# EAGLE schematic 612_jetracer_pico_300 (EAGLE 9.6.0)
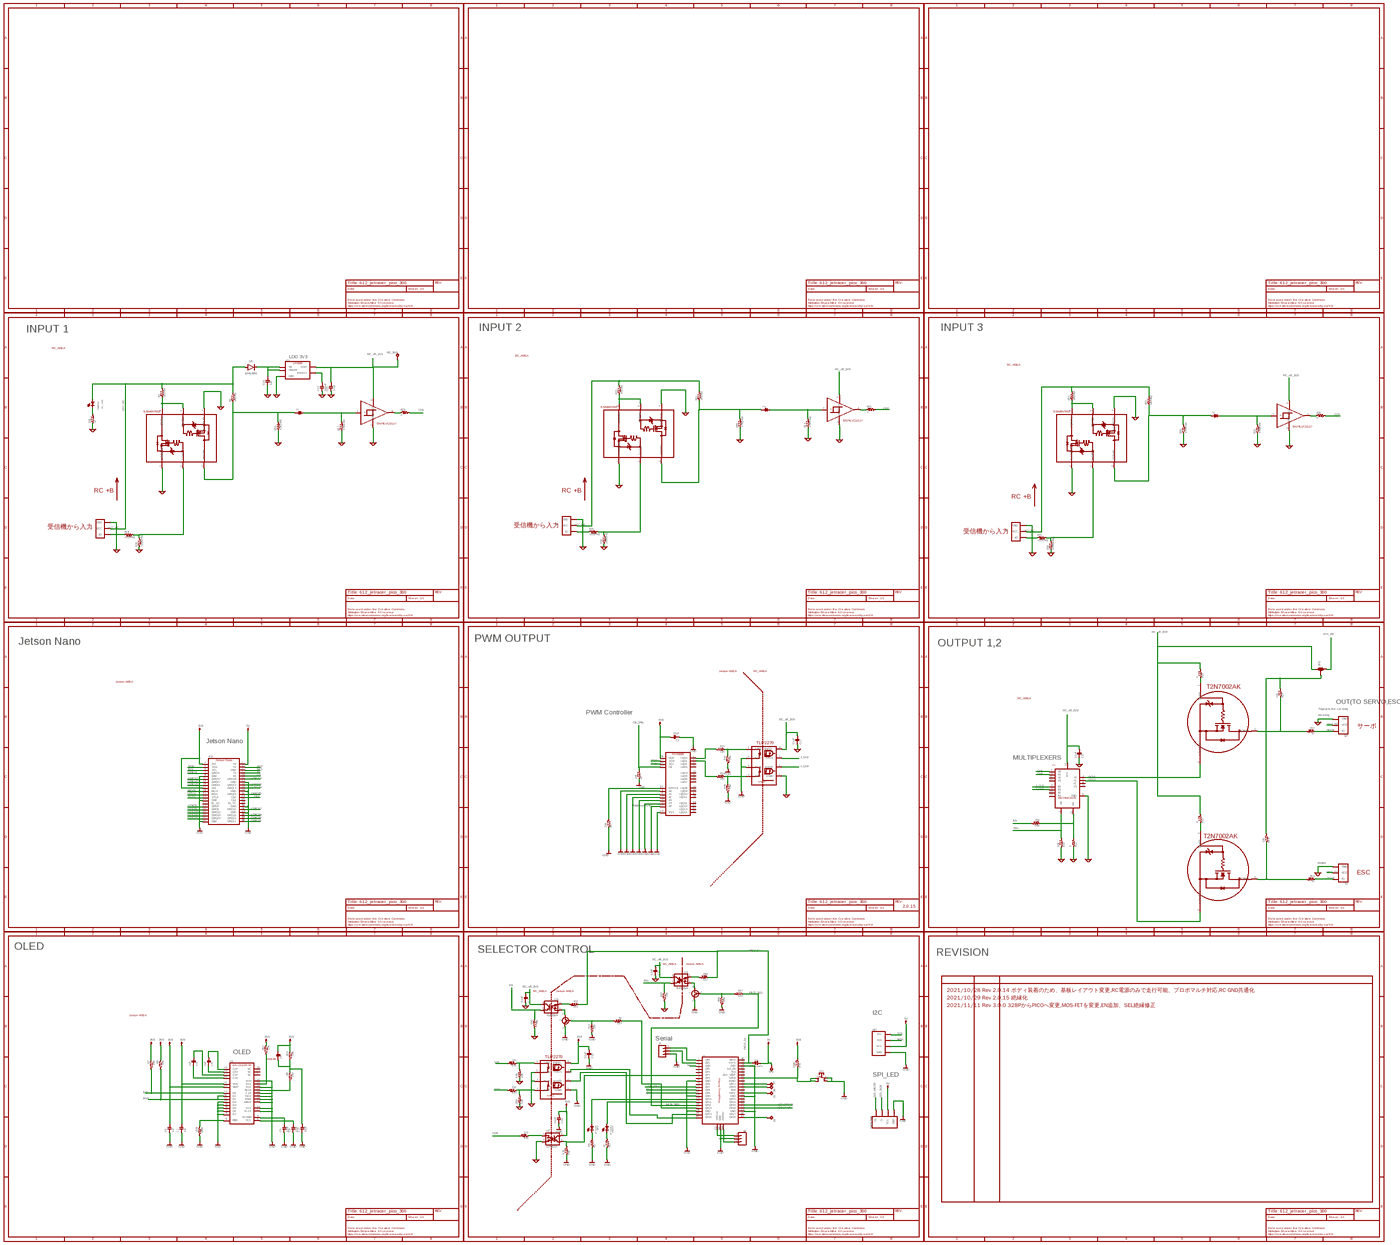
[diagram p0: schematic, sheet 1, overview]
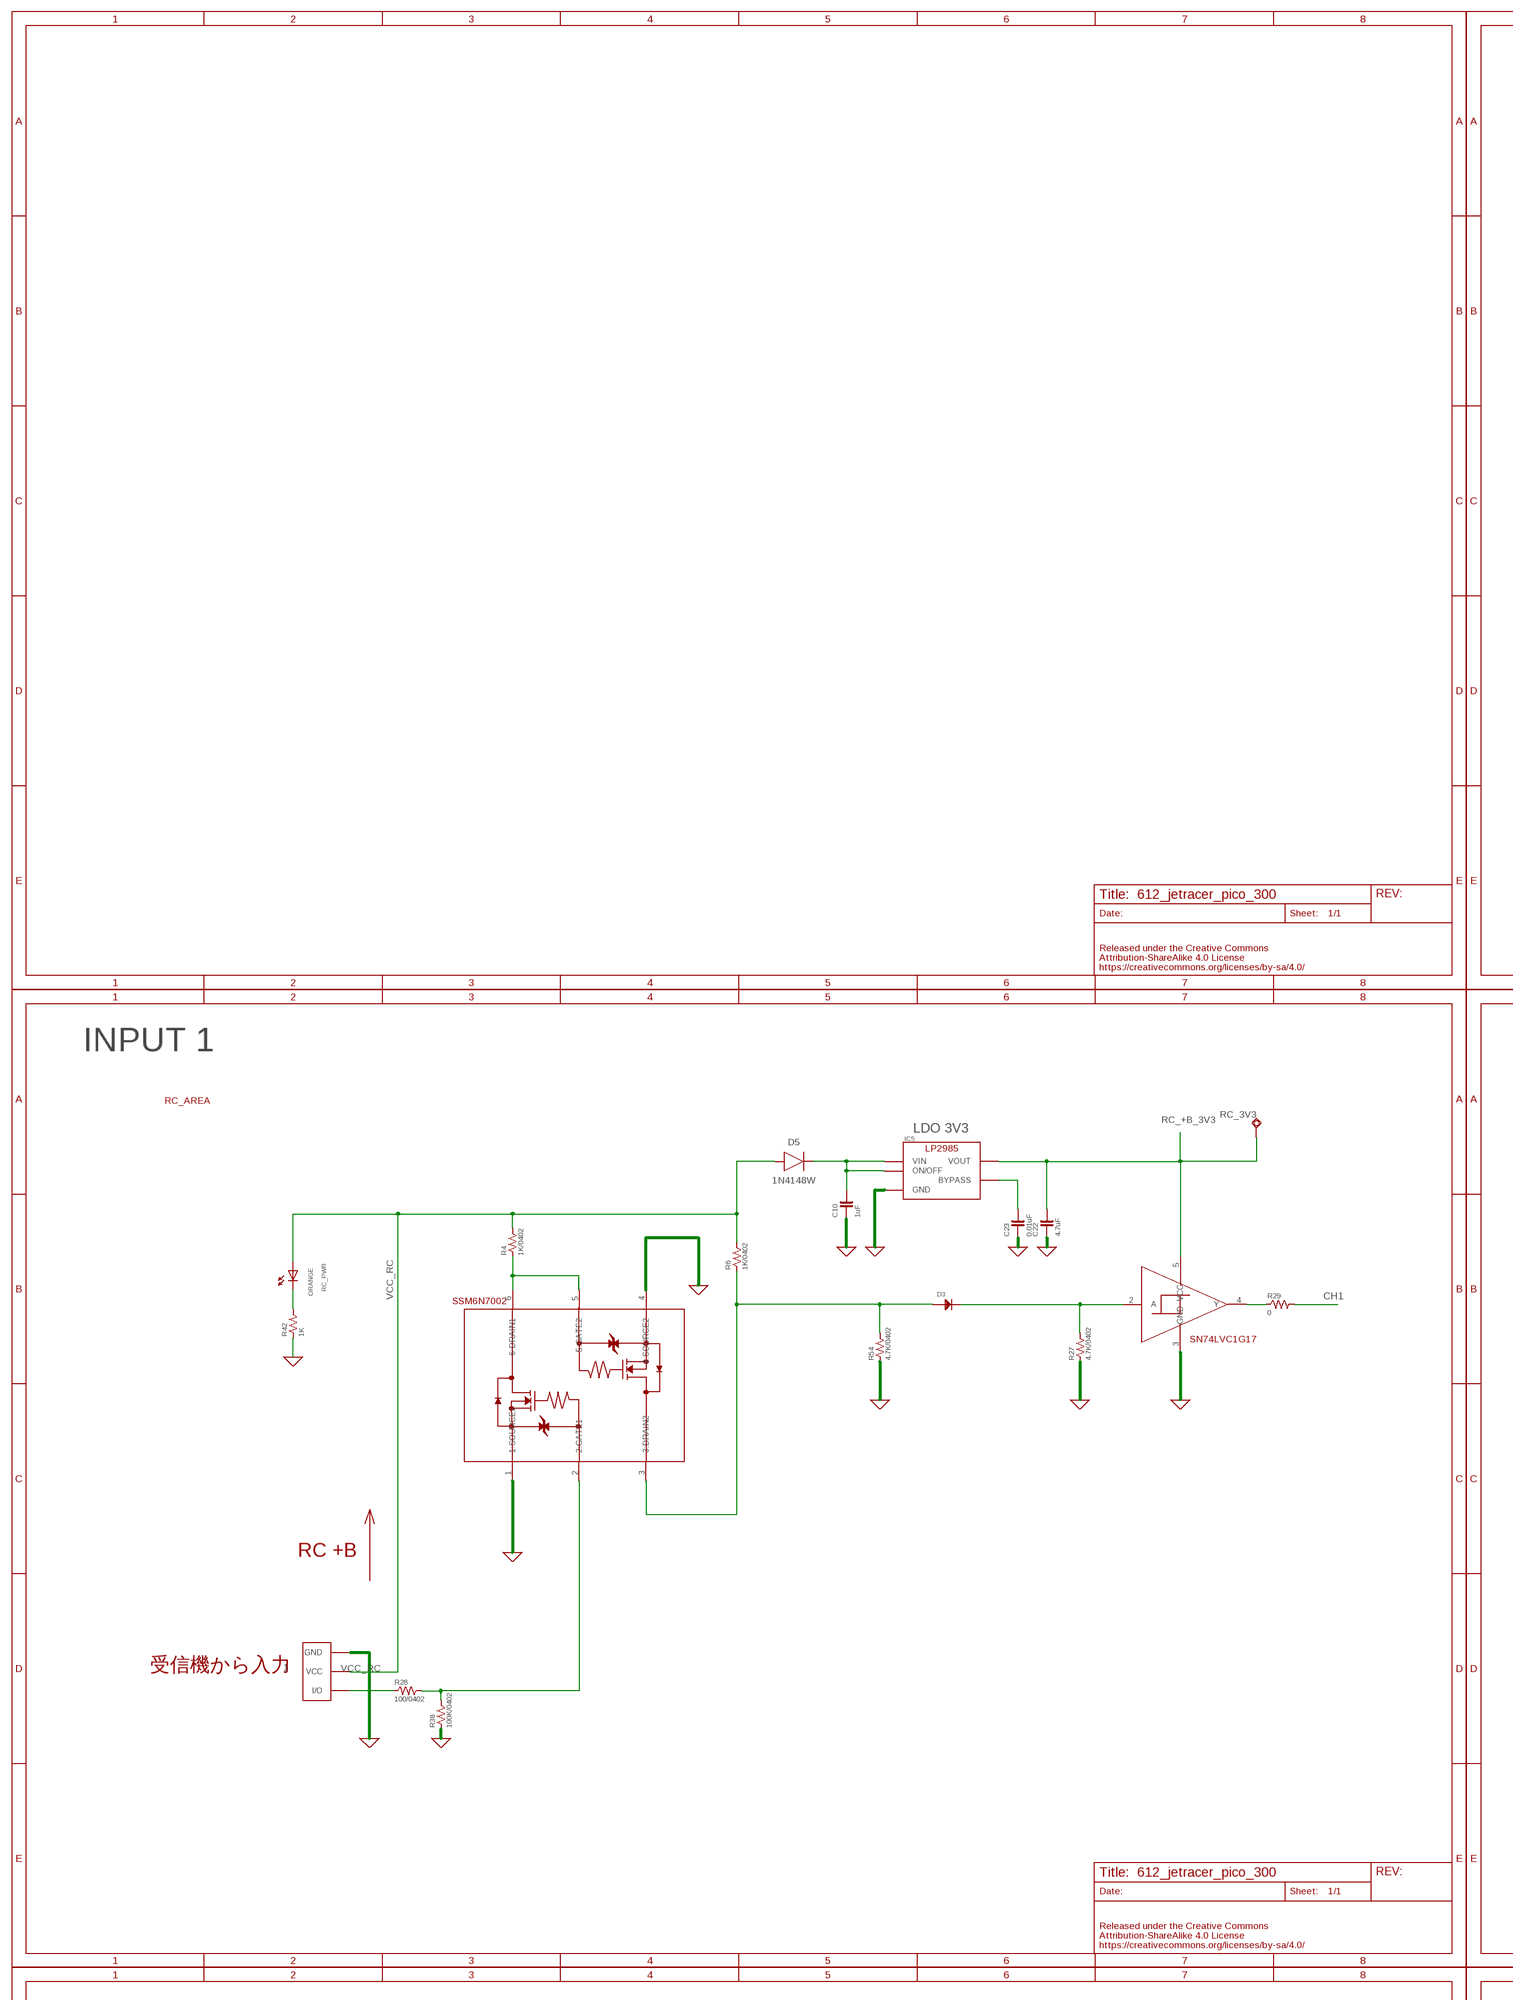
[diagram p1: schematic, sheet 1, part 1 of 6]
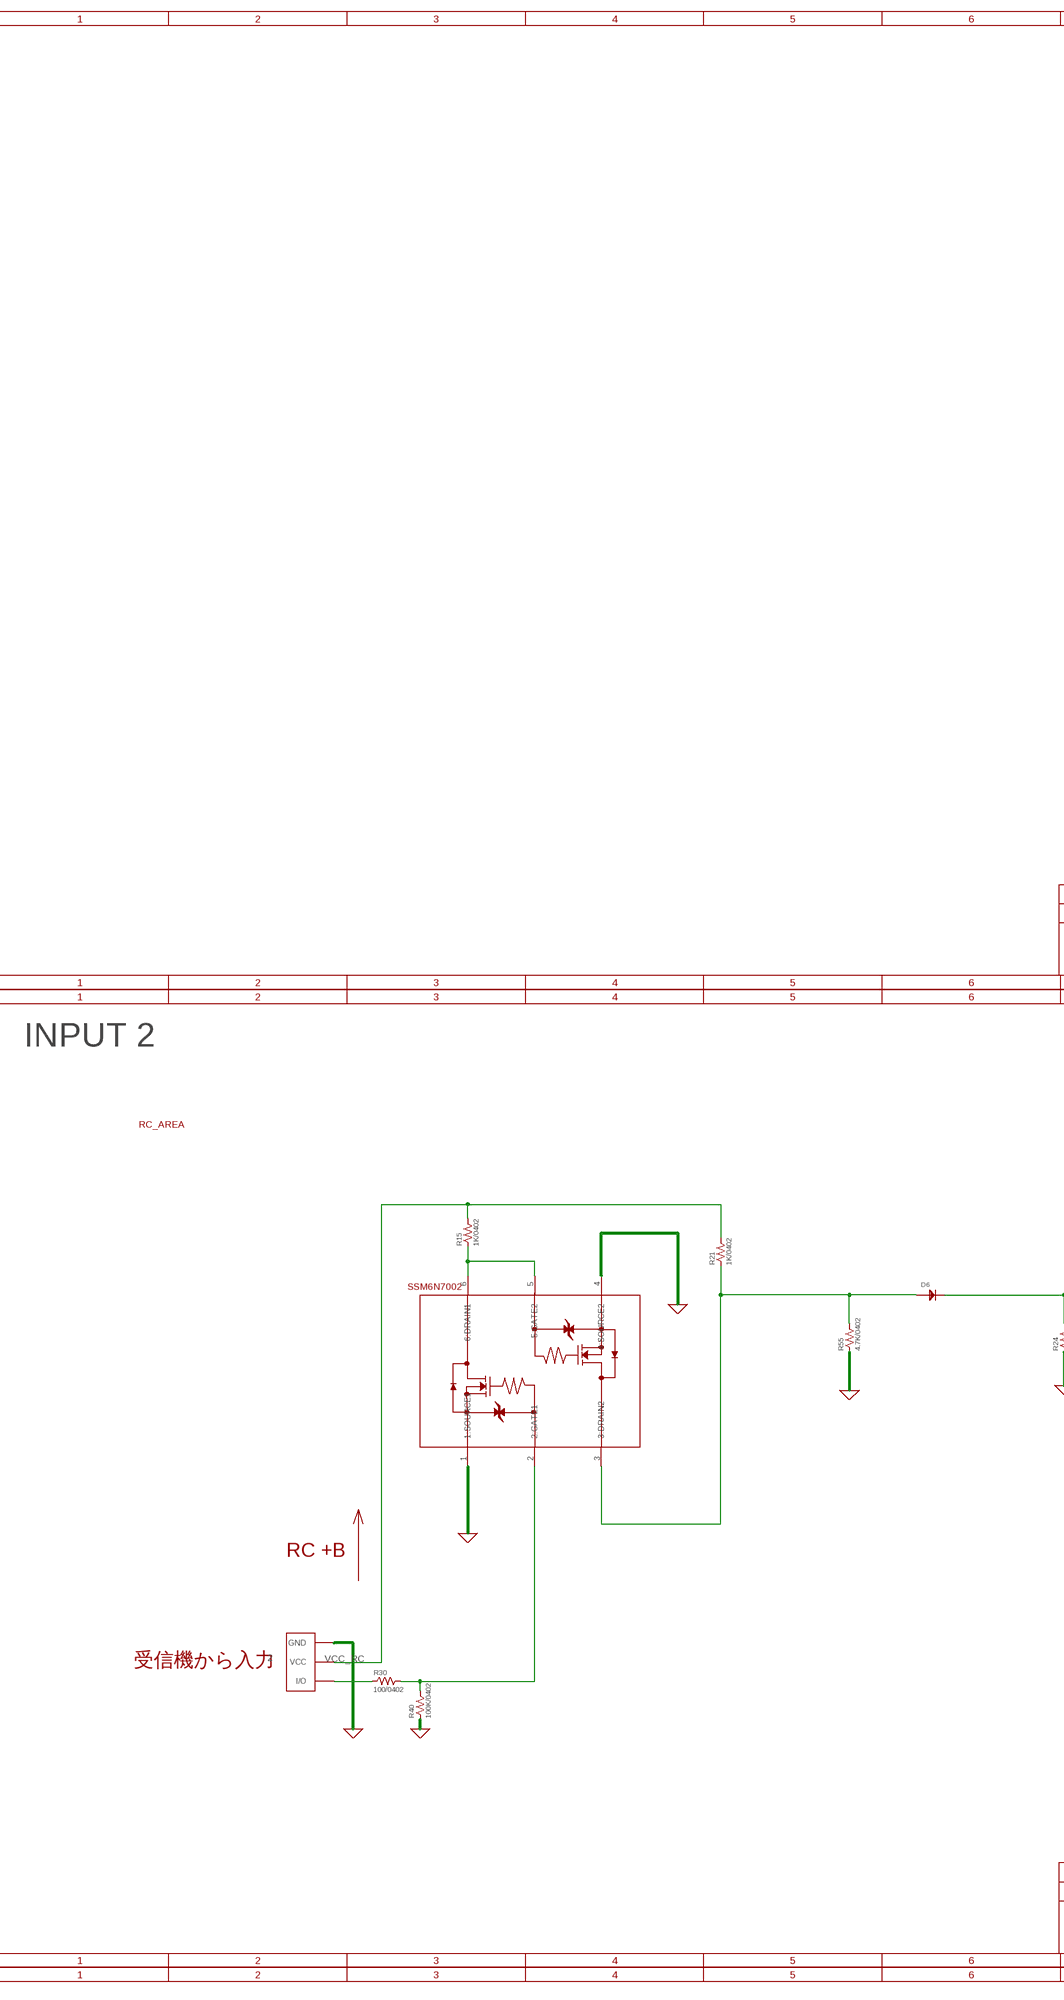
[diagram p2: schematic, sheet 1, part 2 of 6]
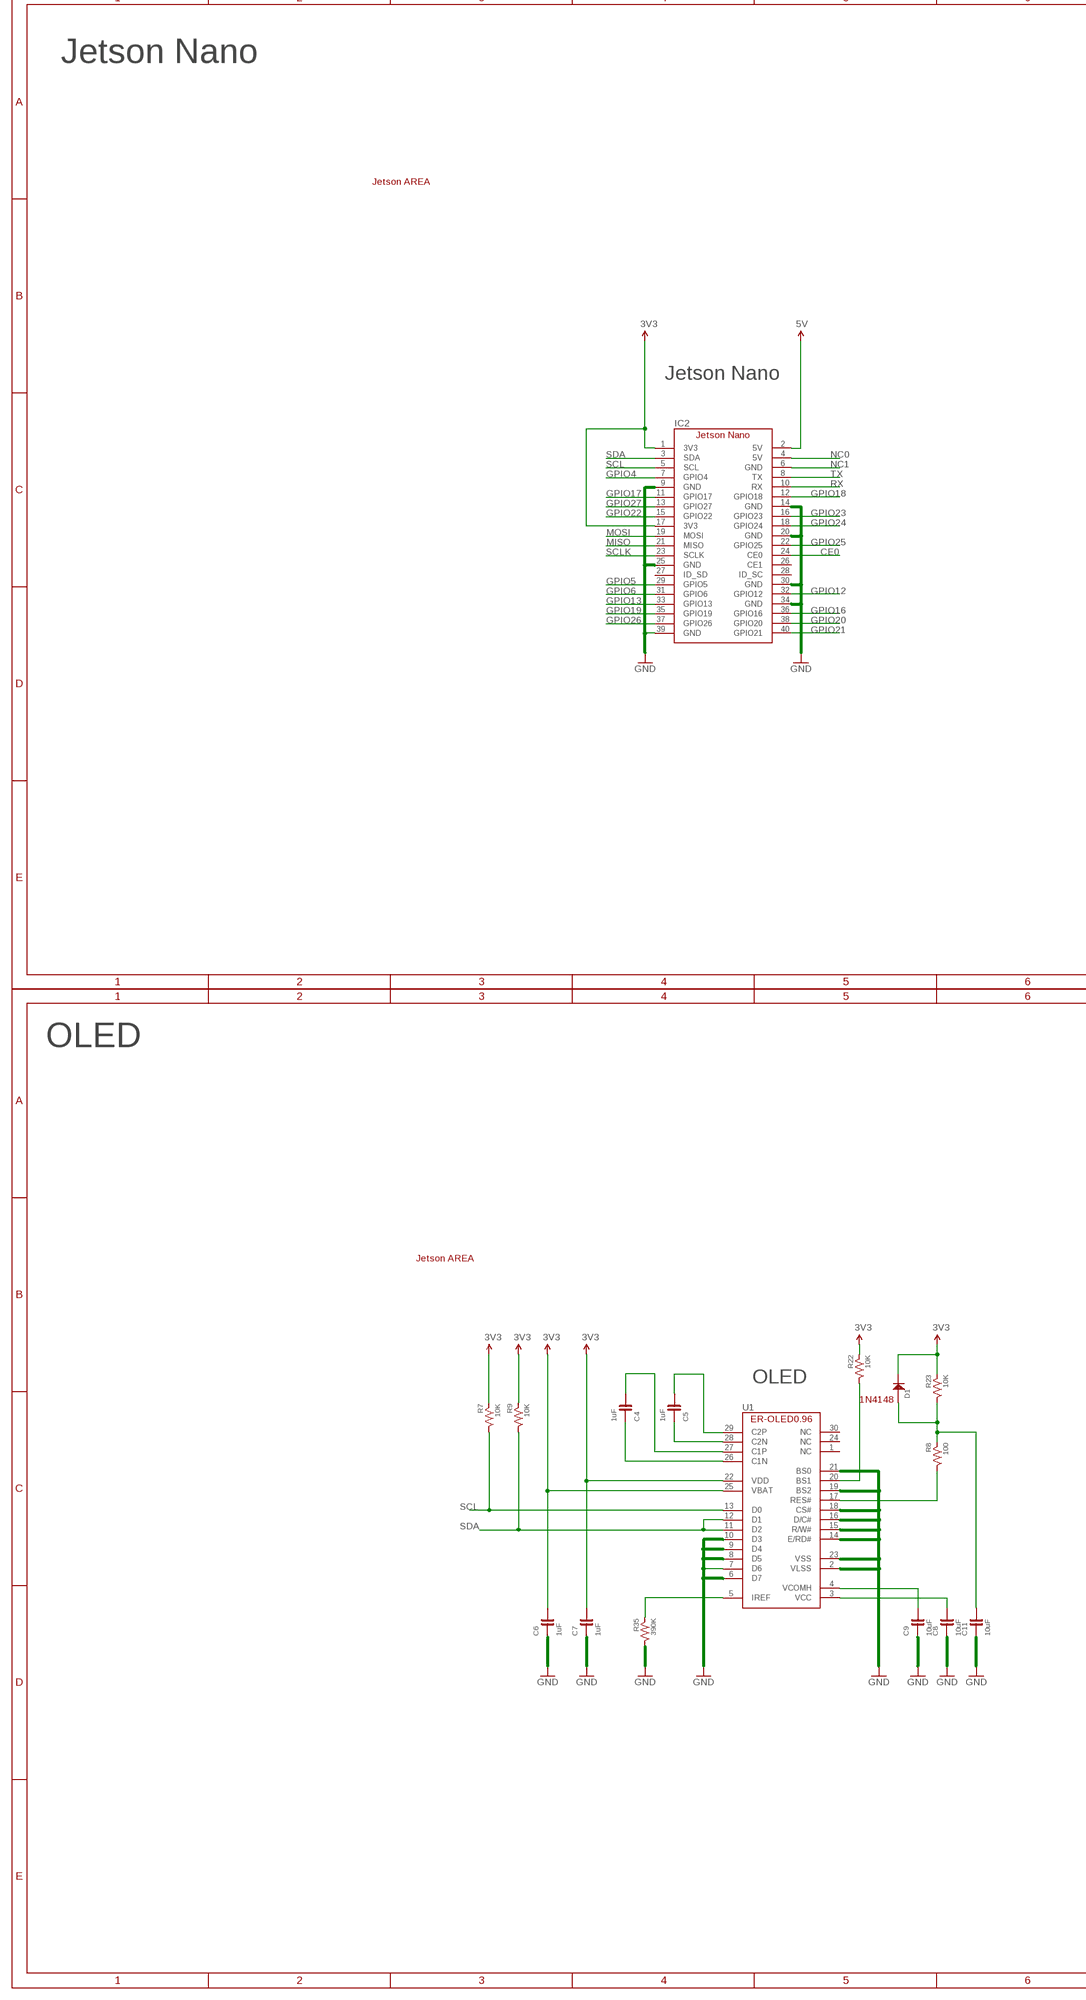
[diagram p3: schematic, sheet 1, part 3 of 6]
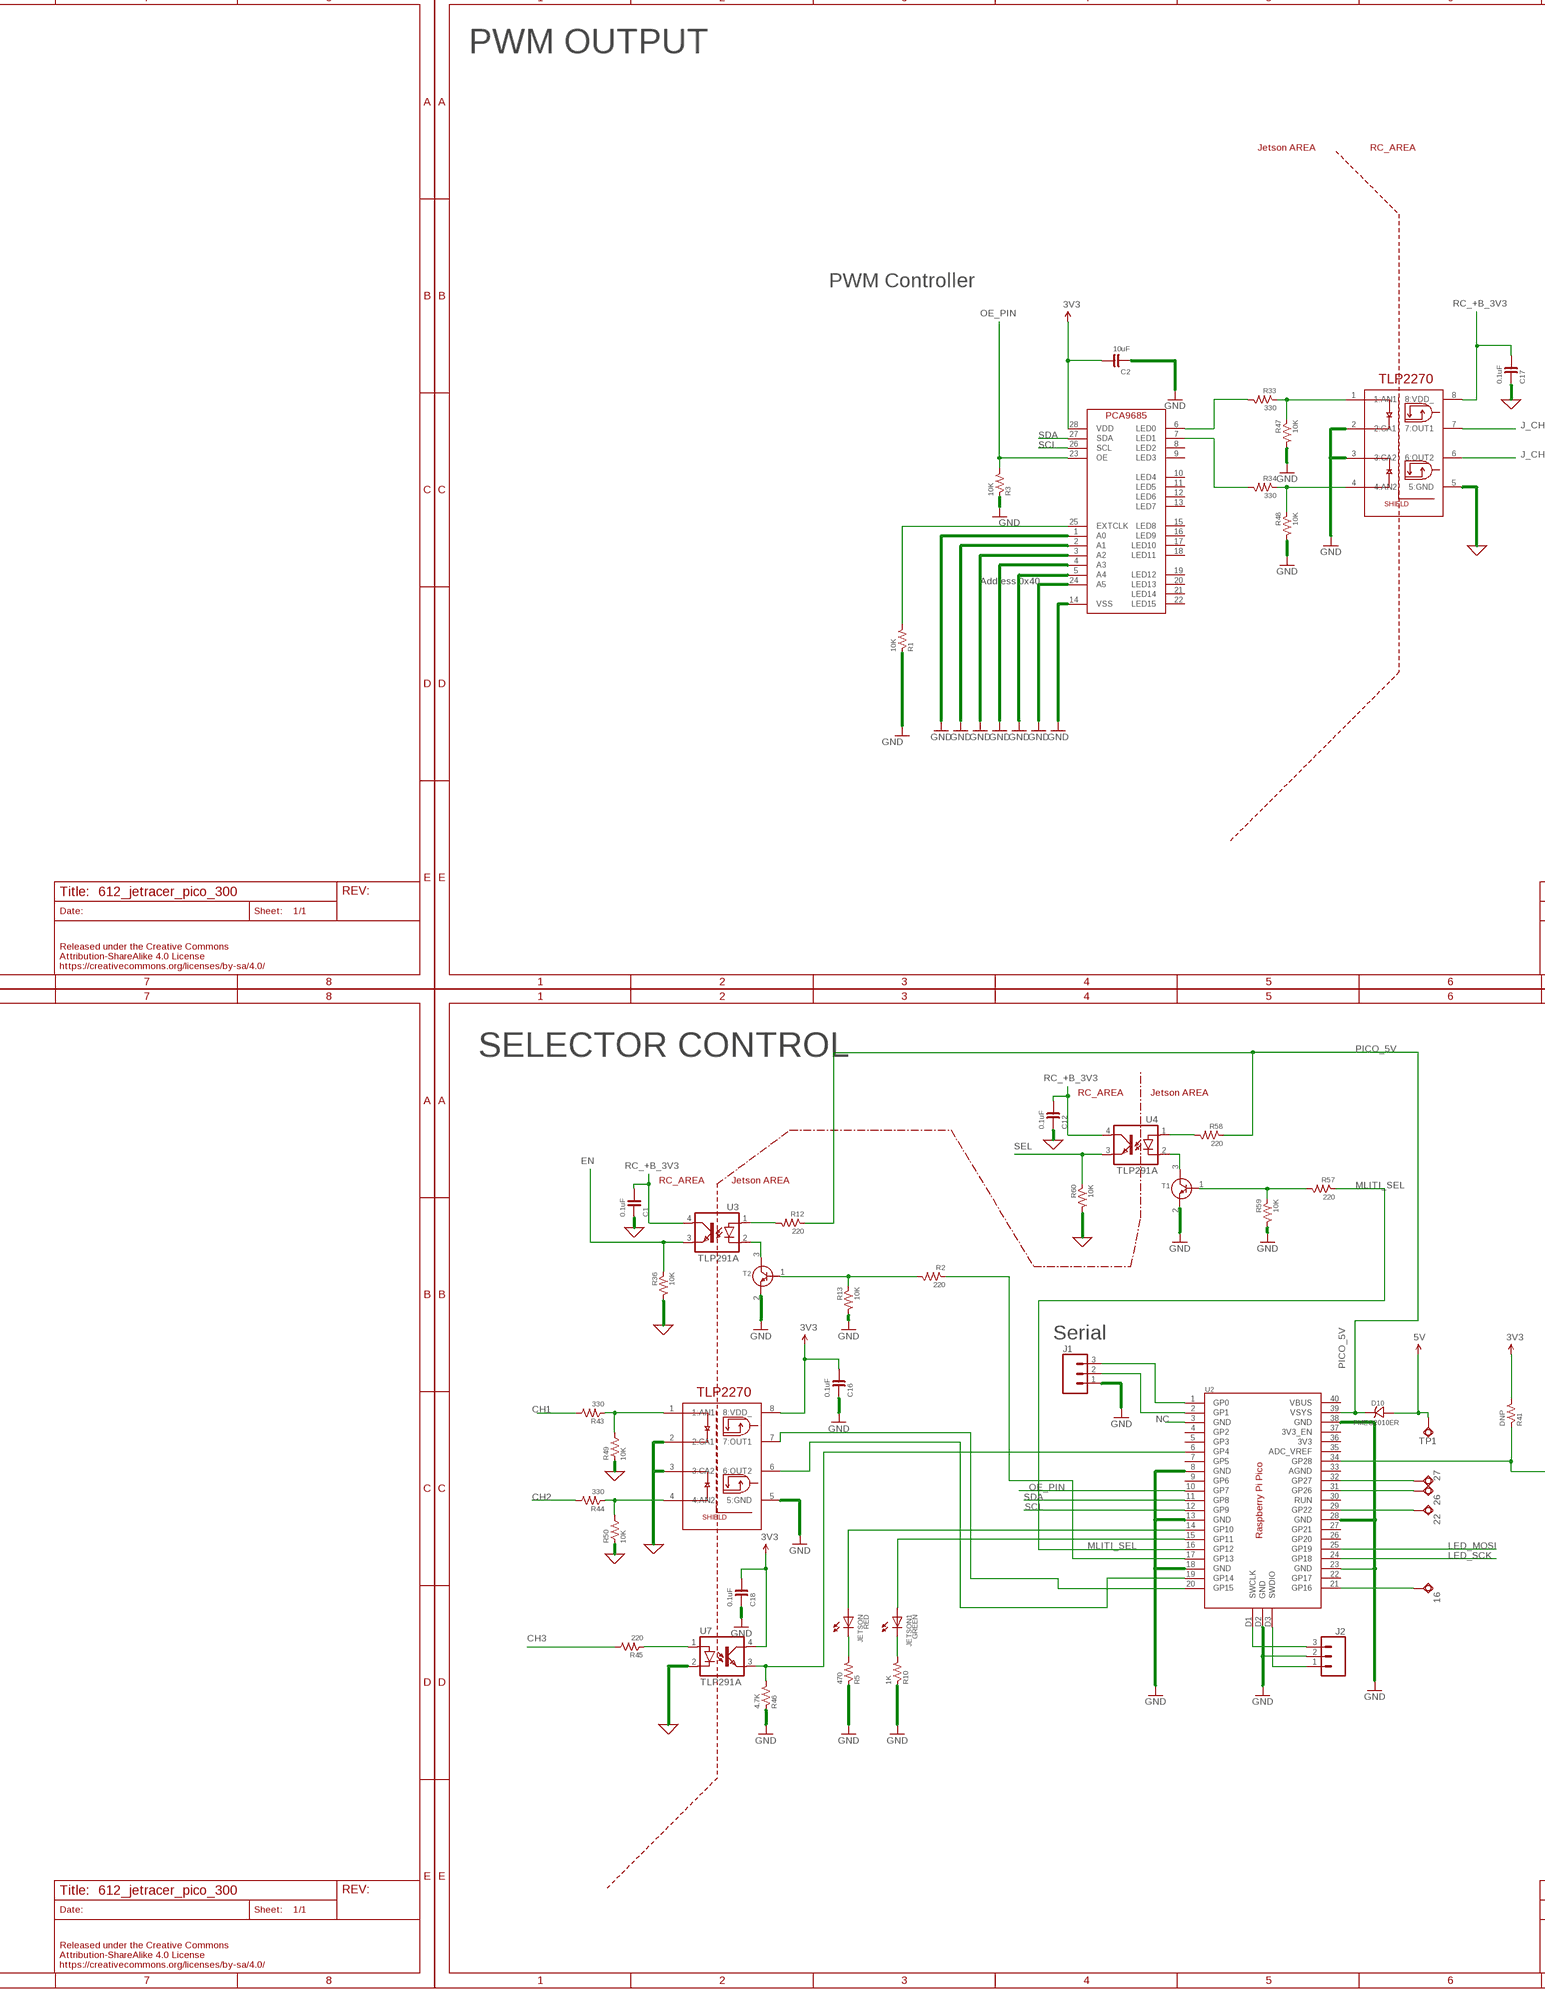
[diagram p4: schematic, sheet 1, part 4 of 6]
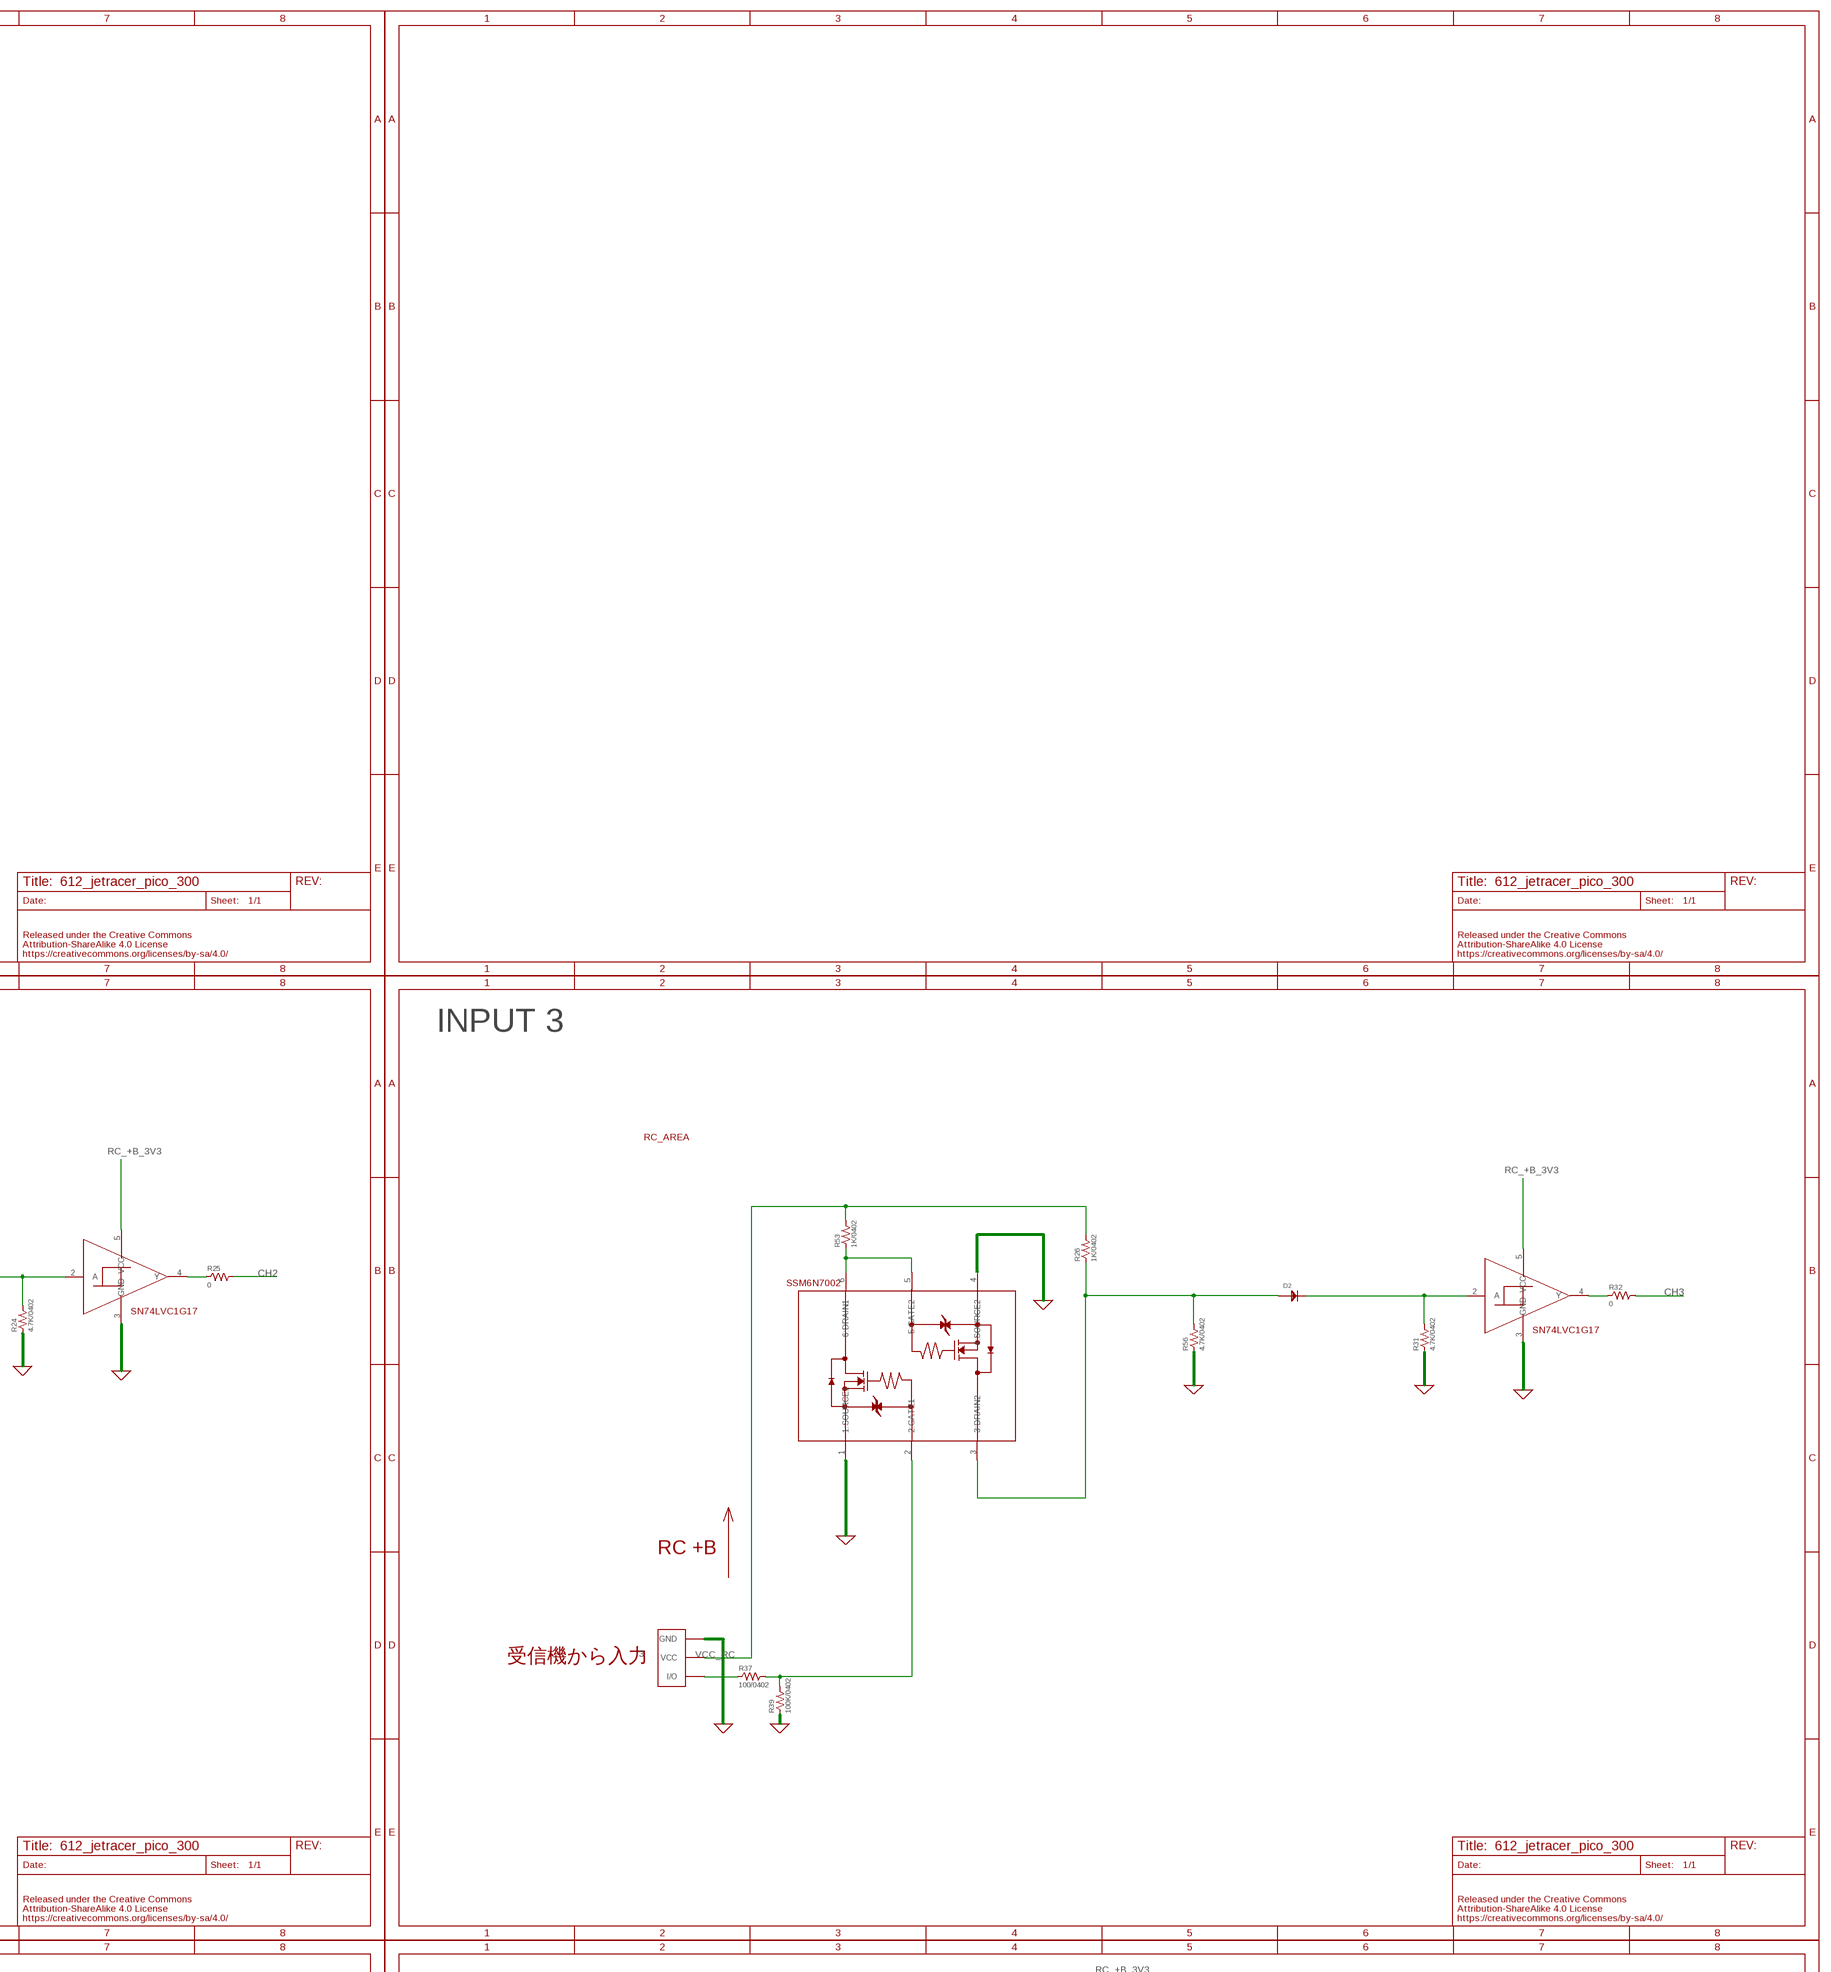
[diagram p5: schematic, sheet 1, part 5 of 6]
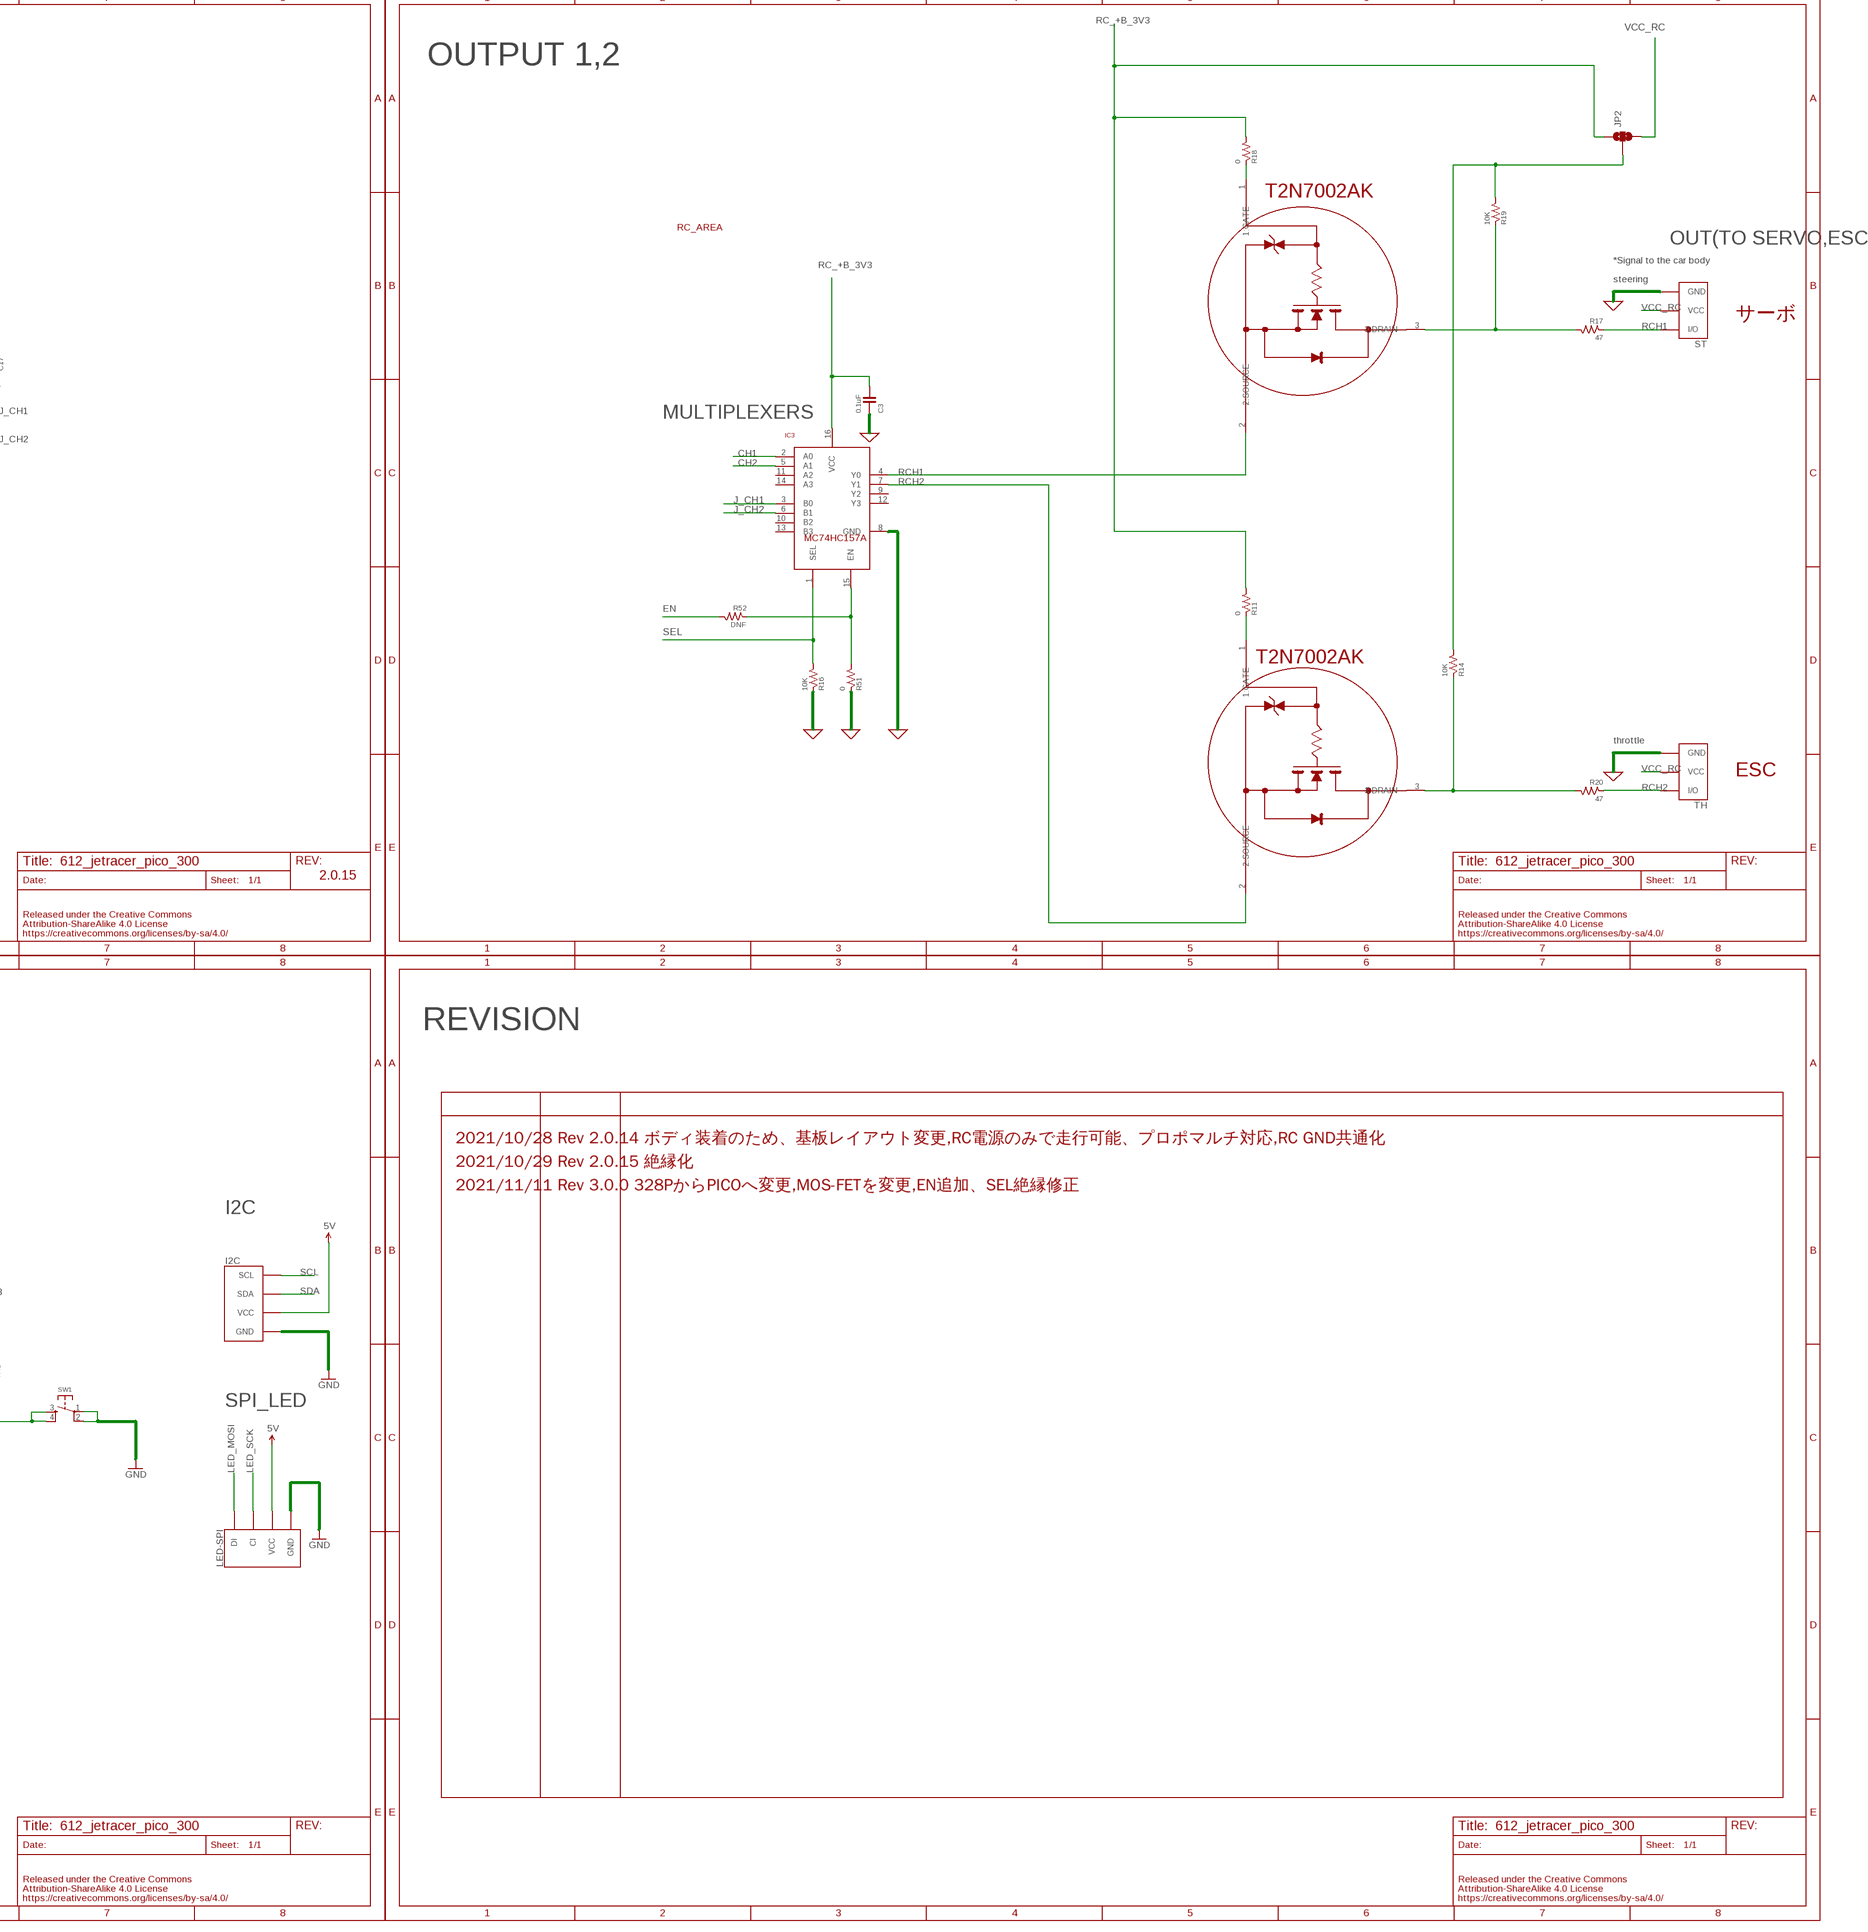
[diagram p6: schematic, sheet 1, part 6 of 6]

## Parts
1  FABO_BRICK_3PIN-HEADER  [FABO_BRICK_3PIN_HEADER]
2  FABO_BRICK_3PIN-HEADER  [FABO_BRICK_3PIN_HEADER]
3  FABO_BRICK_3PIN-HEADER  [FABO_BRICK_3PIN_HEADER]
16  TESTPAD_TPSQTP20R  [TESTPAD_TP20R]
22  TESTPAD_TPSQTP20R  [TESTPAD_TP20R]
26  TESTPAD_TPSQTP20R  [TESTPAD_TP20R]
27  TESTPAD_TPSQTP20R  [TESTPAD_TP20R]
C1  0.1uF  CAPACITOR-0603  [0603]
C2  10uF  CAPACITOR-0603  [0603]
C3  0.1uF  CAPACITOR-0603  [0603]
C4  1uF  CAPACITOR-0603  [0603]
C5  1uF  CAPACITOR-0603  [0603]
C6  1uF  CAPACITOR-0603  [0603]
C7  1uF  CAPACITOR-0603  [0603]
C8  10uF  CAPACITOR-0603  [0603]
C9  10uF  CAPACITOR-0603  [0603]
C10  1uF  CAPACITOR-0603  [0603]
C11  10uF  CAPACITOR-0603  [0603]
C12  0.1uF  CAPACITOR-0603  [0603]
C16  0.1uF  CAPACITOR-0603  [0603]
C17  0.1uF  CAPACITOR-0603  [0603]
C18  0.1uF  CAPACITOR-0603  [0603]
C22  4.7uF  CAPACITOR-0603  [0603]
C23  0.01uF  CAPACITOR-0603  [0603]
D1  1N4148  [1N4148W]
D2  DIODE-SOD-323  [SOD-323]
D3  DIODE-SOD-323  [SOD-323]
D5  1N4148W  DIODE_1N4148W-7-F_SOD123G  [SOD3715X135]
D6  DIODE-SOD-323  [SOD-323]
D10  PMEG2010ER  [SOD123W]
I2C  FABO-I2C_BM04B  [I2C-BM04B-PASS-1]
IC2  JETSON_NANO_NOBORDER  [JETSON_NANO_NOBOARDER]
IC3  MULTIPLEXERSMC74HC157A  [TSSOP-16]
IC4  PCA9685  [PCA9685]
IC5  LP2985-33DBV  [SOT-23-5]
J1  CONN_03SMD_RA_MALE  [1X03_SMD_RA_MALE]
J2  CONN_03SMD_RA_MALE  [1X03_SMD_RA_MALE]
JETSON  GREEN  LED-0603  [0603]
JETSON1  RED  LED-0603  [0603]
JP2  JUMPER-SMT_3_1-NC_TRACE_SILK  [SMT-JUMPER_3_1-NC_TRACE_SILK]
LED-SPI  FABO-SPI-LED-BM04B  [SPI-BM04B-PASS-1]
R1  10K  RESISTOR-0603  [0603]
R2  220  RESISTOR-0603  [0603]
R3  10K  RESISTOR-0603  [0603]
R4  1K/0402  RESISTOR-0402  [0402]
R5  470  RESISTOR-0603  [0603]
R6  1K/0402  RESISTOR-0402  [0402]
R7  10K  RESISTOR-0603  [0603]
R8  100  RESISTOR-0603  [0603]
R9  10K  RESISTOR-0603  [0603]
R10  1K  RESISTOR-0603  [0603]
R11  0  RESISTOR-0603  [0603]
R12  220  RESISTOR-0603  [0603]
R13  10K  RESISTOR-0603  [0603]
R14  10K  RESISTOR-0603  [0603]
R15  1K/0402  RESISTOR-0402  [0402]
R16  10K  RESISTOR-0603  [0603]
R17  47  RESISTOR-0603  [0603]
R18  0  RESISTOR-0603  [0603]
R19  10K  RESISTOR-0603  [0603]
R20  47  RESISTOR-0603  [0603]
R21  1K/0402  RESISTOR-0402  [0402]
R22  10K  RESISTOR-0603  [0603]
R23  10K  RESISTOR-0603  [0603]
R24  4.7K/0402  RESISTOR-0402  [0402]
R25  0  RESISTOR-0603  [0603]
R26  1K/0402  RESISTOR-0402  [0402]
R27  4.7K/0402  RESISTOR-0402  [0402]
R28  100/0402  RESISTOR-0402  [0402]
R29  0  RESISTOR-0603  [0603]
R30  100/0402  RESISTOR-0402  [0402]
R31  4.7K/0402  RESISTOR-0402  [0402]
R32  0  RESISTOR-0603  [0603]
R33  330  RESISTOR-0603  [0603]
R34  330  RESISTOR-0603  [0603]
R35  390K  RESISTOR-0603  [0603]
R36  10K  RESISTOR-0603  [0603]
R37  100/0402  RESISTOR-0402  [0402]
R38  100K/0402  RESISTOR-0402  [0402]
R39  100K/0402  RESISTOR-0402  [0402]
R40  100K/0402  RESISTOR-0402  [0402]
R41  DNP  RESISTOR-0603  [0603]
R42  1K  RESISTOR-0603  [0603]
R43  330  RESISTOR-0603  [0603]
R44  330  RESISTOR-0603  [0603]
R45  220  RESISTOR-0603  [0603]
R46  4.7K  RESISTOR-0603  [0603]
R47  10K  RESISTOR-0603  [0603]
R48  10K  RESISTOR-0603  [0603]
R49  10K  RESISTOR-0603  [0603]
R50  10K  RESISTOR-0603  [0603]
R51  0  RESISTOR-0603  [0603]
R52  DNF  RESISTOR-0603  [0603]
R53  1K/0402  RESISTOR-0402  [0402]
R54  4.7K/0402  RESISTOR-0402  [0402]
R55  4.7K/0402  RESISTOR-0402  [0402]
R56  4.7K/0402  RESISTOR-0402  [0402]
R57  220  RESISTOR-0603  [0603]
R58  220  RESISTOR-0603  [0603]
R59  10K  RESISTOR-0603  [0603]
R60  10K  RESISTOR-0603  [0603]
RC_3V3  TESTPAD_TPSQTP20R  [TESTPAD_TP20R]
RC_PWR  ORANGE  LED-0603  [0603]
ST  FABO_BRICK_3PIN-HEADER  [FABO_BRICK_3PIN_HEADER]
SW1  TACT-SWITCH-SMD_KMR2  [KMR2]
T1  TRANSISTOR-NPN  [SOT-23]
T2  TRANSISTOR-NPN  [SOT-23]
TH  FABO_BRICK_3PIN-HEADER  [FABO_BRICK_3PIN_HEADER]
TP1  TESTPAD_TPSQTP20R  [TESTPAD_TP20R]
U1  ER-OLED0.96-1ER-CON30HT-1  [ER-CON30HT-1]
U2  RASPBERRY_PI_PICO  [RASPBERRY_PI_PICO_SMD]
U3  TLP291A  [11-3C1]
U4  TLP291A  [11-3C1]
U7  TLP291A  [11-3C1]
U$5  TLP2270  [TLP2270]
U$8  TLP2270  [TLP2270]
U$9  SSM6N7002KFU  [US6]
U$11  SSM6N7002KFU  [US6]
U$14  SN74LVC1G17  [SOT-23]
U$20  SN74LVC1G17  [SOT-23]
U$21  SSM6N7002KFU  [US6]
U$23  SN74LVC1G17  [SOT-23]
U$27  T2N7002AK  [SOT-23]
U$28  T2N7002AK  [SOT-23]

## Nets
3V3: C2.2 C6.2 C7.2 C16.2 C18.2 D1.CATHODE IC2.1(3V3) IC2.17(3V3) IC4.28(VDD) R7.1 R9.1 R22.1 R23.1 R41.2 U1.22(VDD) U1.25(VBAT) U7.4(COL) U$8.8(8:VDD_)
5V: D10.2(ANODE) I2C.5V(VCC) IC2.2(5V) LED-SPI.5V(VCC) TP1.TP
CE0: IC2.24(CE0)
CH1: IC3.2(A0) R29.2 R43.2
CH2: IC3.5(A1) R25.2 R44.2
CH3: R32.2 R45.2
D3: JETSON1.ANODE U2.14(GP10)
D4: JETSON.ANODE U2.15(GP11)
EN: R36.1 R52.2 U3.3(EMI)
GND: C2.1 C6.1 C7.1 C8.1 C9.1 C11.1 C16.1 C18.1 I2C.GND IC2.9(GND) IC2.14(GND) IC2.20(GND) IC2.25(GND) IC2.30(GND) IC2.34(GND) IC2.39(GND) IC4.1(A0) IC4.2(A1) IC4.3(A2) IC4.4(A3) IC4.5(A4) IC4.14(VSS) IC4.24(A5) J1.1 J2.2 LED-SPI.GND R1.1 R3.1 R5.1 R10.1 R13.2 R35.2 R46.1 R47.2 R48.2 R59.2 SW1.1 SW1.2 T1.2(E) T2.2(E) U1.2(VLSS) U1.6(D7) U1.7(D6) U1.8(D5) U1.9(D4) U1.10(D3) U1.14(E/RD#) U1.15(R/W#) U1.16(D/C#) U1.18(CS#) U1.19(BS2) U1.21(BS0) U1.23(VSS) U2.8(GND) U2.13(GND) U2.18(GND) U2.23(GND) U2.28(GND) U2.38(GND) U2.D2(GND) U$5.2(2:CA1) U$5.3(3:CA2) U$8.5(5:GND)
GPIO4: IC2.7(GPIO4)
GPIO5: IC2.29(GPIO5)
GPIO6: IC2.31(GPIO6)
GPIO12: IC2.32(GPIO12)
GPIO13: IC2.33(GPIO13)
GPIO16: IC2.36(GPIO16)
GPIO17: IC2.11(GPIO17)
GPIO18: IC2.12(GPIO18)
GPIO19: IC2.35(GPIO19)
GPIO20: IC2.38(GPIO20)
GPIO21: IC2.40(GPIO21)
GPIO22: IC2.15(GPIO22)
GPIO23: IC2.16(GPIO23)
GPIO24: IC2.18(GPIO24)
GPIO25: IC2.22(GPIO25)
GPIO26: IC2.37(GPIO26)
GPIO27: IC2.13(GPIO27)
J_CH1: IC3.3(B0) U$5.7(7:OUT1)
J_CH2: IC3.6(B1) U$5.6(6:OUT2)
LED_MOSI: LED-SPI.DI U2.25(GP19)
LED_SCK: LED-SPI.CI U2.24(GP18)
MISO: IC2.21(MISO)
MLITI_SEL: R57.1 U2.16(GP12)
MOSI: IC2.19(MOSI)
N$2: R28.2 R38.2 U$9.2(2:GATE1)
N$3: R14.1 R20.2 U$27.3(3:DRAIN)
N$5: 22.TP U2.29(GP22)
N$6: R2.1 U2.17(GP13)
N$7: R41.1 SW1.3 SW1.4 U2.34(GP28)
N$8: IC4.25(EXTCLK) R1.2
N$9: R11.1 U$27.1(1:GATE)
N$10: R17.1 ST.I/O
N$11: R30.2 R40.2 U$11.2(2:GATE1)
N$12: D3.A(ANODE) R6.1 R54.2 U$9.3(3:DRAIN2)
N$13: 2.I/O R30.1
N$14: R20.1 TH.I/O
N$15: 26.TP U2.31(GP26)
N$16: C4.2 U1.27(C1P)
N$17: R18.1 U$28.1(1:GATE)
N$18: R15.1 U$11.5(5:GATE2) U$11.6(6:DRAIN1)
N$19: JETSON1.CATHODE R5.2
N$20: JETSON.CATHODE R10.2
N$21: C4.1 U1.26(C1N)
N$22: C5.1 U1.28(C2N)
N$23: C5.2 U1.29(C2P)
N$24: R35.1 U1.5(IREF)
N$25: C9.2 U1.4(VCOMH)
N$26: C8.2 U1.3(VCC)
N$27: R8.2 U1.17(RES#)
N$28: C11.2 D1.ANODE R8.1 R23.2
N$29: D6.A(ANODE) R21.1 R55.2 U$11.3(3:DRAIN2)
N$30: D6.K(CATHODE) R24.2 U$20.2(A)
N$31: R25.1 U$20.4(Y)
N$32: 3.I/O R37.1
N$33: R53.1 U$21.5(5:GATE2) U$21.6(6:DRAIN1)
N$34: D3.K(CATHODE) R27.2 U$14.2(A)
N$35: R29.1 U$14.4(Y)
N$36: D2.A(ANODE) R26.1 R56.2 U$21.3(3:DRAIN2)
N$37: D2.K(CATHODE) R31.2 U$23.2(A)
N$38: R32.1 U$23.4(Y)
N$39: R17.2 R19.1 U$28.3(3:DRAIN)
N$40: 27.TP U2.32(GP27)
N$41: JP2.2 R14.2 R19.2
N$42: IC4.6(LED0) R33.2
N$43: IC4.7(LED1) R34.2
N$44: 1.I/O R28.1
N$45: IC3.15(EN) R51.2 R52.1
N$46: R37.2 R39.2 U$21.2(2:GATE1)
N$47: C23.2 IC5.4(BYPASS)
N$48: C10.2 D5.1(C) IC5.1(VIN) IC5.3(ON/OFF)
N$49: R42.2 RC_PWR.CATHODE
N$50: R22.2 U1.20(BS1)
N$51: 16.TP U2.21(GP16)
N$52: J2.3 U2.D1(SWCLK)
N$53: R33.1 R47.1 U$5.1(1:AN1)
N$54: R34.1 R48.1 U$5.4(4:AN2)
N$55: U2.20(GP15) U$8.7(7:OUT1)
N$56: U2.19(GP14) U$8.6(6:OUT2)
N$57: R43.1 R49.2 U$8.1(1:AN1)
N$58: R44.1 R50.2 U$8.4(4:AN2)
N$59: R45.1 U7.1(A)
N$60: R46.2 U2.6(GP4) U7.3(EMI)
N$61: R4.1 U$9.5(5:GATE2) U$9.6(6:DRAIN1)
N$62: T2.3(C) U3.2(C)
N$63: R12.2 U3.1(A)
N$64: R2.2 R13.1 T2.1(B)
N$65: J2.1 U2.D3(SWDIO)
N$66: T1.3(C) U4.2(C)
N$67: R58.2 U4.1(A)
N$68: R57.2 R59.1 T1.1(B)
NC: U2.3(GND)
NC0: IC2.4(5V)
NC1: IC2.6(GND)
OE_PIN: IC4.23(OE) R3.2 U2.10(GP7)
PICO_5V: D10.1(CATHODE) R12.1 R58.1 U2.39(VSYS)
PICO_RX: J1.2 U2.2(GP1)
PICO_TX: J1.3 U2.1(GP0)
RC_+B_3V3: C1.2 C3.2 C12.2 C17.2 C22.2 IC3.16(VCC) IC5.5(VOUT) JP2.1 R11.2 R18.2 RC_3V3.TP U3.4(COL) U4.4(COL) U$5.8(8:VDD_) U$14.5(VCC) U$20.5(VCC) U$23.5(VCC)
RC_GND: 1.GND 2.GND 3.GND C1.1 C3.1 C10.1 C12.1 C17.1 C22.1 C23.1 IC3.8(GND) IC5.2(GND) R16.1 R24.1 R27.1 R31.1 R36.2 R38.1 R39.1 R40.1 R42.1 R49.1 R50.1 R51.1 R54.1 R55.1 R56.1 R60.2 ST.GND TH.GND U7.2(C) U$5.5(5:GND) U$8.2(2:CA1) U$8.3(3:CA2) U$9.1(1:SOURCE1) U$9.4(4:SOURCE2) U$11.1(1:SOURCE1) U$11.4(4:SOURCE2) U$14.3(GND) U$20.3(GND) U$21.1(1:SOURCE1) U$21.4(4:SOURCE2) U$23.3(GND) ; supply symbol labelled GND
RCH1: IC3.4(Y0) U$28.2(2:SOURCE)
RCH2: IC3.7(Y1) U$27.2(2:SOURCE)
RX: IC2.10(RX)
SCL: I2C.SCL IC2.5(SCL) IC4.26(SCL) R7.2 U1.13(D0) U2.12(GP9)
SCLK: IC2.23(SCLK)
SDA: I2C.SDA IC2.3(SDA) IC4.27(SDA) R9.2 U1.11(D2) U1.12(D1) U2.11(GP8)
SEL: IC3.1(SEL) R16.2 R60.1 U4.3(EMI)
TX: IC2.8(TX)
VCC_RC: 1.VCC 2.VCC 3.VCC D5.2(A) JP2.3 R4.2 R6.2 R15.2 R21.2 R26.2 R53.2 RC_PWR.ANODE ST.VCC TH.VCC
Unconnected: IC2.26(CE1) IC2.27(ID_SD) IC2.28(ID_SC) IC3.9(Y2) IC3.10(B2) IC3.11(A2) IC3.12(Y3) IC3.13(B3) IC3.14(A3) IC4.8(LED2) IC4.9(LED3) IC4.10(LED4) IC4.11(LED5) IC4.12(LED6) IC4.13(LED7) IC4.15(LED8) IC4.16(LED9) IC4.17(LED10) IC4.18(LED11) IC4.19(LED12) IC4.20(LED13) IC4.21(LED14) IC4.22(LED15) U1.1(NC) U1.24(NC) U1.30(NC) U2.4(GP2) U2.5(GP3) U2.7(GP5) U2.9(GP6) U2.22(GP17) U2.26(GP20) U2.27(GP21) U2.30(RUN) U2.33(AGND) U2.35(ADC_VREF) U2.36(3V3) U2.37(3V3_EN) U2.40(VBUS)

## Notes on the sheet
- INPUT 1 | INPUT 2 | INPUT 3
- RC_AREA
- RC_AREA
- LDO 3V3
- RC_AREA
- SN74LVC1G17
- SN74LVC1G17
- SN74LVC1G17
- RC +B | RC +B
- RC +B
- 受信機から入力 | 受信機から入力
- 受信機から入力
- Jetson Nano | PWM OUTPUT
- OUTPUT 1,2
- Jetson AREA | RC_AREA
- Jetson AREA
- T2N7002AK
- RC_AREA
- OUT(TO SERVO,ESC)
- *Signal to the car body
- PWM Controller
- steering
- サーボ
- Jetson Nano
- MULTIPLEXERS
- MC74HC157A
- Address 0x40
- T2N7002AK
- throttle
- ESC
- 2.0.15
- OLED | SELECTOR CONTROL
- REVISION
- RC_AREA | Jetson AREA
- RC_AREA | Jetson AREA | 2021/10/28 Rev 2.0.14 ボディ装着のため、基板レイアウト変更,RC電源のみで走行可能、プロポマルチ対応,RC GND共通化
- 2021/10/29 Rev 2.0.15 絶縁化
- 2021/11/11 Rev 3.0.0 328PからPICOへ変更,MOS-FETを変更,EN追加、SEL絶縁修正
- I2C
- Jetson AREA
- Serial
- OLED
- 1N4148
- SPI_LED

## Library data of the parts
1-3 ST TH = FaBo-Template:FABO_BRICK_3PIN: FaBo Brick 3pin
16 22 26 27 RC_3V3 TP1 = BeagleBone_Blue_R3:TESTPAD_TPSQ: Test pad
C1-C12 C16-C18 C22 C23 = FaBo-Capacitor:CAPACITOR: CAPACITOR
D1 = FaBo-Diode:1N4148
D2 D3 D6 = FaBo-Diode:DIODE
D5 = Diode:DIODE_: Diode Rectifier - Popular parts; CATEGORY: Diode; DESCRIPTION: DIODE GEN PURP 100V 300MA SOD123; MANUFACTURER: Diodes Incorporated; SUB-CATEGORY: Rectifier
D10 = FaBo-Diode:PMEG2010ER
I2C = FaBo-Connetor:FABO-I2C
IC2 = FaBo-Boards:JETSON_NANO
IC3 = FaBo-Multiplexers:MULTIPLEXERS
IC4 = FaBo-Motor:PCA9685
IC5 = FaBo-Supply:LP2985: LP2985
J1 J2 = SparkFun-Connectors:CONN_03: Multi connection point. Often used as Generic Header-pin footprint for 0.1 inch spaced/style header connections On any of the 0.1 inch spaced packages, you can populate with these: Break Away Headers - Straight <https://www.sparkfun.com/products/116> (PRT-00116) Break Away Male Headers - Right Angle <https://www.sparkfun.com/products/553> (PRT-00553) Female Headers <https://www.sparkfun.com/products/115> (PRT-00115) Break Away Headers - Machine Pin <https://www.sparkfun.com/products/117> (PRT-00117) Break Away Female Headers - Swiss Machine Pin <https://www.sparkfun.com/products/743> (PRT-00743) Stackable Header - 3 Pin (Female, 0.1") <https://www.sparkfun.com/products/13875> (PRT-13875) For SCREWTERMINALS and SPRING TERMINALS visit here: Screw Terimnals on SparkFun.com <https://www.sparkfun.com/search/results?term=Screw+Terminals> (5mm/3.5mm/2.54mm spacing) This device is also useful as a general connection point to wire up your design to another part of your project. Our various solder wires solder well into these plated through hole pads. Hook-Up Wire - Assortment (Stranded, 22 AWG) <https://www.sparkfun.com/products/11375> (PRT-11375) Hook-Up Wire - Assortment (Solid Core, 22 AWG) <https://www.sparkfun.com/products/11367> (PRT-11367) View the entire wire category on our website here <https://www.sparkfun.com/categories/141> Special notes: Molex polarized connector foot print use with SKU : PRT-08232 with associated crimp pins and housings.; PROD_ID: CONN-10925
JETSON JETSON1 RC_PWR = FaBo-LED:LED
JP2 = SparkFun-Jumpers:JUMPER-SMT_3_1-NC_TRACE: Normally closed trace jumper (1 of 2 connections) This jumper has a trace between two pads so it's normally closed (NC). The other connection is normally open (NO). Use a razor knife to open the connection. For best results follow the IPC guidelines for cutting traces: Cutout at least 0.063 mm (0.005 in). Remove all loose material to clean up the cut area. Seal the cut with an approved epoxy. Reapply solder to reclose the connection, or to close the NO connection.
LED-SPI = FaBo-Connetor:FABO-SPI-LED
R1-R60 = FaBo-Resistors:RESISTOR: RESISTOR
SW1 = FaBo-Switch:TACT-SWITCH: Part No Maker Datasheet Distributor 1273HA-160G-G SWITRONIC Catalog <http://www.switronic.com/uploads/images/A10.gif> Akizuki <http://akizukidenshi.com/catalog/g/gP-02561/> DTS-6-V Cosland DTS 6 Series <http://www.cosland.com/newproduct/DTS%20SERIES.pdf> Akizuki <http://akizukidenshi.com/catalog/g/gP-03647/> KMR2 C&K KMR2 SERIES <https://www.ckswitches.com/products/switches/product-details/Tactile/KMR2/> Octoparts Result <https://octopart.com/search?q=KMR2&start=0> TSHA-T-XB2-19E TOP UP INDUSTORY TSHA-T <http://www.top-up.com.tw/front/bin/ptdetail.phtml?Part=TSHA-T> Akizuki <http://akizukidenshi.com/catalog/g/gP-09361/>
T1 T2 = FaBo-Transistor:TRANSISTOR
U1 = FaBo-Display:ER-OLED0.96-1
U2 = FaBo-Boards:RASPBERRY_PI_PICO
U3 U4 U7 = FaBo_Photocoupler:TLP291A; SPICEPREFIX: E
U$5 U$8 = FaBo_Photocoupler:TLP2270
U$9 U$11 U$21 = FaBo-Mosfet:SSM6N7002KFU
U$14 U$20 U$23 = FaBo-LogicIC:SN74LVC1G17
U$27 U$28 = FaBo-Mosfet:T2N7002AK